# Altium schematic sheet [3] CAN.SchDoc
size A4; DocumentNumber: 3; SheetNumber: 4; SheetTotal: 10
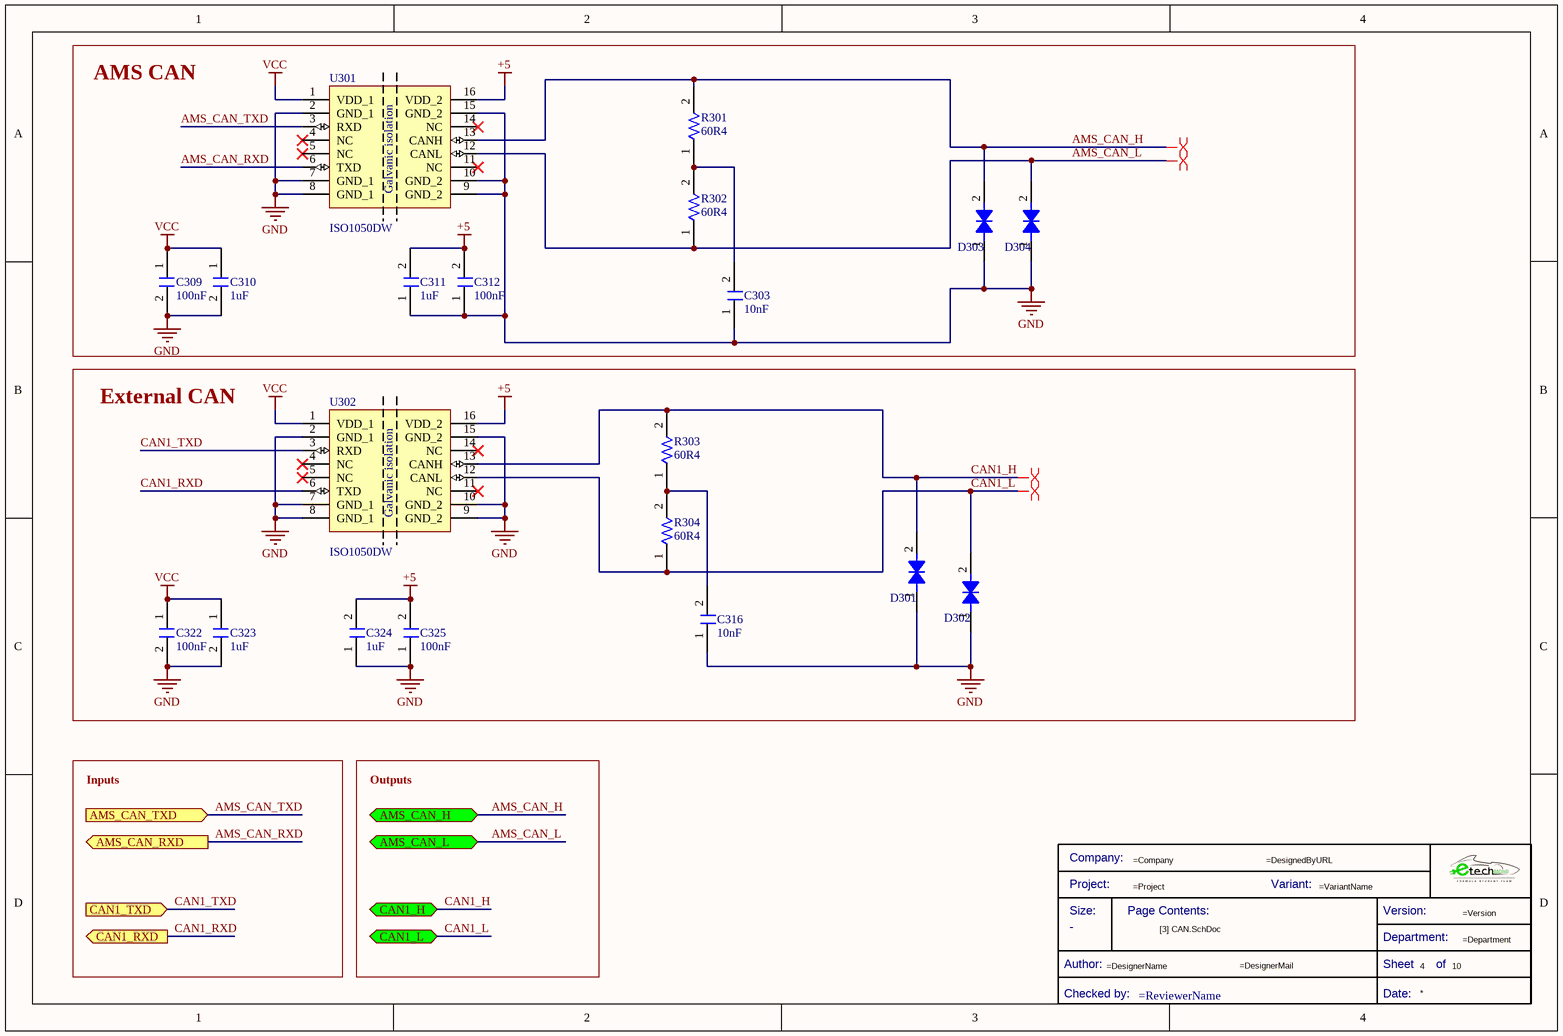
[diagram p0: [3] CAN.SchDoc]

## Parts
*  Title Block_template  (value not drawn)  (graphical)
C303  Capacitance: 10nF  [C0805FNPC-R]  (hidden comment: 885012207092)
C309  Capacitance: 100nF  [C0805FNPC-R]  (hidden comment: 885012207098)
C310  Capacitance: 1uF  [C0805FNPC-R]  (hidden comment: 885012207103)
C311  Capacitance: 1uF  [C0805FNPC-R]  (hidden comment: 885012207103)
C312  Capacitance: 100nF  [C0805FNPC-R]  (hidden comment: 885012207098)
C316  Capacitance: 10nF  [C0805FNPC-R]  (hidden comment: 885012207092)
C322  Capacitance: 100nF  [C0805FNPC-R]  (hidden comment: 885012207098)
C323  Capacitance: 1uF  [C0805FNPC-R]  (hidden comment: 885012207103)
C324  Capacitance: 1uF  [C0805FNPC-R]  (hidden comment: 885012207103)
C325  Capacitance: 100nF  [C0805FNPC-R]  (hidden comment: 885012207098)
D301  824501600  [DTVS-DO-214AC]  (value not drawn)
D302  824501600  [DTVS-DO-214AC]  (value not drawn)
D303  824501600  [DTVS-DO-214AC]  (value not drawn)
D304  824501600  [DTVS-DO-214AC]  (value not drawn)
R301  value 60R4  [R0805FTK]  (hidden comment: R60-0805FTN)
R302  value 60R4  [R0805FTK]  (hidden comment: R60-0805FTN)
R303  value 60R4  [R0805FTK]  (hidden comment: R60-0805FTN)
R304  value 60R4  [R0805FTK]  (hidden comment: R60-0805FTN)
U301  ISO1050DW  [TRANSCEIVER_CAN_SOIC16]
U302  ISO1050DW  [TRANSCEIVER_CAN_SOIC16]

## Blocks framed on the sheet
AMS CAN: C303 C309-C312 D303 D304 R301 R302 U301
External CAN: C316 C322-C325 D301 D302 R303 R304 U302

## Ports
AMS_CAN_H (bidir), AMS_CAN_L (bidir), AMS_CAN_RXD (out), AMS_CAN_TXD (in), CAN1_H (bidir), CAN1_L (bidir), CAN1_RXD (out), CAN1_TXD (in)

## Nets
+5: C311.2 C312.2 C324.2 C325.2 U301.16(VDD_2) U302.16(VDD_2)
GND: C303.1 C309.2 C310.2 C311.1 C312.1 C316.1 C322.2 C323.2 C324.1 C325.1 D301.1 D302.1 D303.1 D304.1 U301.2(GND_1) U301.7(GND_1) U301.8(GND_1) U301.9(GND_2) U301.10(GND_2) U301.15(GND_2) U302.2(GND_1) U302.7(GND_1) U302.8(GND_1) U302.9(GND_2) U302.10(GND_2) U302.15(GND_2)
VCC: C309.1 C310.1 C322.1 C323.1 U301.1(VDD_1) U302.1(VDD_1)
AMS_CAN_H: D303.2 R301.2 U301.13(CANH) ; port AMS_CAN_H
AMS_CAN_L: D304.2 R302.1 U301.12(CANL) ; port AMS_CAN_L
AMS_CAN_RXD: U301.6(TXD) ; port AMS_CAN_RXD
AMS_CAN_TXD: U301.3(RXD) ; port AMS_CAN_TXD
CAN1_H: D301.2 R303.2 U302.13(CANH) ; port CAN1_H
CAN1_L: D302.2 R304.1 U302.12(CANL) ; port CAN1_L
CAN1_RXD: U302.6(TXD) ; port CAN1_RXD
CAN1_TXD: U302.3(RXD) ; port CAN1_TXD
NetC303_2: C303.2 R301.1 R302.2
NetC316_2: C316.2 R303.1 R304.2

Not connected (* = marked no-connect by the designer): U301 4(NC)* 5(NC)* 11(NC)* 14(NC)*; U302 4(NC)* 5(NC)* 11(NC)* 14(NC)*

## Layout directives
differential pair: AMS_CAN_H, AMS_CAN_L, CAN1_H, CAN1_L

## Notes on the sheet
- Inputs
- Outputs
- Title
- Size:
- Date:
- A4
- Number:
- Time:
- Revision:
- Sheet
- of
- File:
- (in symbol Title Block_template) Company:; Project:; Variant:; Size:; Page Contents:; Version:; Department:; Author:; Sheet; of; Checked by:; Date:
- (in symbol Transceiver_CAN_ISO1050) Galvanic isolation

## Library data of the parts
* = Title Block_template: Standard Title Block; Category: Title Block; Checked by:: =ReviewerName; Size: -
C303 C316 = C10n-50V-0805FNPC-X7R: Cap, 0.01ΜF, 50V, 10%, X7R, 0805; Manufacturer 1: Wurth Electronics; .Creator: DR; Supplier 1: RSComponents; Manufacturer Part Number 1: 885012207092; RoHS: Yes; Category: Ceramic Capacitors; Stock 1: 1; Pricing 1: 4000=0,03200, 12000=0,03100 (USD); Mount: Surface Mount; Case/Package: 0805; Case Code (Metric): 2012; Case Code (Imperial): 0805; Min Operating Temperature: -55°C; Max Operating Temperature: 125°C; Packaging: Cut Tape; Voltage Rating: 50V; Dielectric: X7R; Tolerance: 10%; Voltage Rating (DC): 50V; Length: 0.079inch; Width: 0.049inch; Thickness: 0.035inch; REACH SVHC: Unknown; RoHS Compliant: Yes; ComponentLink1URL: http://www.farnell.com/datasheets/1958497.pdf?src-supplier=Farnell; ComponentLink1Description: http://www.farnell.com/datasheets/1958497.pdf?src-supplier=Farnell; ComponentLink2URL: http://www.farnell.com/datasheets/1958497.pdf?src-supplier=Element14; ComponentLink2Description: http://www.farnell.com/datasheets/1958497.pdf?src-supplier=Element14; ComponentLink3URL: http://www.farnell.com/datasheets/1958497.pdf?src-supplier=Newark; ComponentLink3Description: http://www.farnell.com/datasheets/1958497.pdf?src-supplier=Newark; ComponentLink4URL: https://katalog.we-online.de/pbs/datasheet/885012207092.pdf?src-supplier=Digi-Key; ComponentLink4Description: https://katalog.we-online.de/pbs/datasheet/885012207092.pdf?src-supplier=Digi-Key; Supplier Part Number 1: 1813941
C309 C312 C322 C325 = C100n-50V-0805FNPC-X7R: Cap, 0.1ΜF, 50V, 10%, X7R, 0805; Manufacturer 1: Wurth Electronics; .Creator: DR; Supplier 1: RSComponents; Manufacturer Part Number 1: 885012207098; RoHS: Yes; Category: Ceramic Capacitors; Stock 1: 8000; Pricing 1: 100=0,10200, 500=0,07100, 2000=0,06100 (GBP); Mount: Surface Mount; Case/Package: 0805; Case Code (Metric): 2012; Case Code (Imperial): 0805; Min Operating Temperature: -55°C; Max Operating Temperature: 125°C; Packaging: Cut Tape; Voltage Rating: 50V; Dielectric: X7R; Tolerance: 10%; Voltage Rating (DC): 50V; Length: 0.079inch; Width: 0.049inch; Thickness: 0.035inch; REACH SVHC: Unknown; RoHS Compliant: Yes; ComponentLink1URL: http://www.farnell.com/datasheets/1958498.pdf?src-supplier=Farnell; ComponentLink1Description: http://www.farnell.com/datasheets/1958498.pdf?src-supplier=Farnell; ComponentLink2URL: http://www.farnell.com/datasheets/1958498.pdf?src-supplier=Element14; ComponentLink2Description: http://www.farnell.com/datasheets/1958498.pdf?src-supplier=Element14; ComponentLink3URL: https://katalog.we-online.de/pbs/datasheet/885012207098.pdf?src-supplier=Digi-Key; ComponentLink3Description: https://katalog.we-online.de/pbs/datasheet/885012207098.pdf?src-supplier=Digi-Key; ComponentLink4URL: http://www.farnell.com/datasheets/1958498.pdf?src-supplier=Newark; ComponentLink4Description: http://www.farnell.com/datasheets/1958498.pdf?src-supplier=Newark; Supplier Part Number 1: 1813493
C310 C311 C323 C324 = C1u-50V-0805FNPC-X7R: Multilayer Ceramic Capacitor, Wcap-Csgp Series, 1 F, 10%, X7R, 50 V, 0805 [2012 Metric] Rohs Compliant: Yes; Manufacturer 1: Wurth Electronics; Voltage Rating: 50V; .Creator: GP; Supplier 1: RSComponents; Manufacturer Part Number 1: 885012207103; RoHS: Yes; Category: Ceramic Capacitors; Stock 1: 5100; Pricing 1: 50=0,27200, 250=0,25300, 500=0,22800, 1250=0,20100, 2500=0,17100 (GBP); Mount: Surface Mount; Case/Package: 0805; Case Code (Metric): 2012; Case Code (Imperial): 0805; Min Operating Temperature: -55°C; Max Operating Temperature: 85°C; Packaging: Cut Tape; Dielectric: X7R; Tolerance: 10%; Voltage Rating (DC): 50V; Length: 0.079inch; Width: 0.049inch; Thickness: 0.053inch; REACH SVHC: Unknown; RoHS Compliant: Yes; ComponentLink1URL: http://www.farnell.com/datasheets/1958501.pdf?src-supplier=Farnell; ComponentLink1Description: http://www.farnell.com/datasheets/1958501.pdf?src-supplier=Farnell; ComponentLink2URL: http://www.farnell.com/datasheets/1958501.pdf?src-supplier=Element14; ComponentLink2Description: http://www.farnell.com/datasheets/1958501.pdf?src-supplier=Element14; ComponentLink3URL: https://katalog.we-online.de/pbs/datasheet/885012107003.pdf?src-supplier=Digi-Key; ComponentLink3Description: https://katalog.we-online.de/pbs/datasheet/885012107003.pdf?src-supplier=Digi-Key; ComponentLink4URL: http://www.farnell.com/datasheets/1958501.pdf?src-supplier=Newark; ComponentLink4Description: http://www.farnell.com/datasheets/1958501.pdf?src-supplier=Newark; Supplier Part Number 1: 1813523
D301-D304 = DTVS-6V-DO-214AC: TVS diode [Würth Elektronik] 824501600 TVS diode; Manufacturer: Wurth Electronics; Number of Bidirectional Channels: 1; Reverse Standoff Voltage: 6V; Min Breakdown Voltage: 7.02V; Clamping Voltage: 10.3V; Peak Pulse Power: 400W; Power Line Protection: No; Polarity: Bidirectional; Peak Pulse Current: 38.8A; .Creator: DO; ComponentLink1Description: Where buy it; ComponentLink1URL: https://www.we-online.com/catalog/en/WE-TVSP?sq=824501600#824501600; Supplier 1: Mouser; Manufacturer Part Number: 824501600; RoHS: Yes; Category: TVS Diodes; Stock 1: 780; Pricing 1: 1=0,28000, 10=0,26100, 50=0,26100, 100=0,23400, 500=0,20400, 1000=0,17400, 10000=0,17400 (USD); Mount: Surface Mount; Number of Pins: 2; Min Operating Temperature: -65°C; Max Operating Temperature: 150°C; Packaging: Cut Tape; Max Breakdown Voltage: 7.02V; Resistor Type: Zener; REACH SVHC: Unknown; RoHS Compliant: Yes; ComponentLink2URL: http://www.farnell.com/datasheets/2036401.pdf?src-supplier=Element14; ComponentLink2Description: http://www.farnell.com/datasheets/2036401.pdf?src-supplier=Element14; Supplier Part Number 1: 710-824501600; ComponentLink3URL: https://katalog.we-online.de/pbs/datasheet/824501600.pdf?src-supplier=Digi-Key; ComponentLink3Description: https://katalog.we-online.de/pbs/datasheet/824501600.pdf?src-supplier=Digi-Key
R301-R304 = R60-0805FTN: Res Thin Film 0805 60.4 Ohm 0.1% 1/8W ±25ppm/°C Molded SMD SMD Punched Carrier T/R; Manufacturer 1: Panasonic; Manufacturer Part Number 1: ERA-6AEB60R4V; Resistance: 60.4R; Voltage Rating (DC): 100V; Max Power Dissipation: 125mW; Voltage Rating: 200V; .Creator: DR; Supplier 1: Arrow Electronics; RoHS: Yes; Category: Chip SMD Resistors; Stock 1: 5000; Pricing 1: 1=0,04650, 10=0,03900, 100=0,02860 (USD); Mount: Surface Mount; Case/Package: 0805; Number of Pins: 2; Contact Plating: Tin; Weight: 0.000194oz; Case Code (Metric): 2012; Case Code (Imperial): 0805; Min Operating Temperature: -55°C; Max Operating Temperature: 155°C; Temperature Coefficient: 25ppm/°C; Tolerance: 0.1%; Resistor Type: Thin Film,Metal Film; Features: Automotive AEC-Q200; Package Quantity: 5000; Number of Terminations: 2; Termination: SMD/SMT; Power Rating: 125mW; Packaging: Tape and Reel; Length: 2mm; Width: 1.25mm; Height: 0.5mm; Depth: 1.25mm; Radiation Hardening: No; Lead Free: Lead Free; ComponentLink1URL: https://datasheet.ciiva.com/11811/0900766b80eb1d8c-11811180.pdf?src-supplier=RSComponents; ComponentLink1Description: https://datasheet.ciiva.com/11811/0900766b80eb1d8c-11811180.pdf?src-supplier=RSComponents; ComponentLink2URL: https://datasheet.ciiva.com/41450/001181146-da-01-en-widerstand-era-0805-60r4-0-1-5000st-41450303.pdf?src-supplier=Conrad; ComponentLink2Description: https://datasheet.ciiva.com/41450/001181146-da-01-en-widerstand-era-0805-60r4-0-1-5000st-41450303.pdf?src-supplier=Conrad; ComponentLink3URL: https://datasheet.ciiva.com/5951/485442-5951173.pdf?src-supplier=Farnell; ComponentLink3Description: https://datasheet.ciiva.com/5951/485442-5951173.pdf?src-supplier=Farnell; ComponentLink4URL: https://datasheet.ciiva.com/30184/54aoa0000ce26-30184022.pdf?src-supplier=Onlinecomponents.com; ComponentLink4Description: https://datasheet.ciiva.com/30184/54aoa0000ce26-30184022.pdf?src-supplier=Onlinecomponents.com; ComponentLink5URL: https://datasheet.ciiva.com/9188/aoa0000ce26-9188476.pdf?src-supplier=Avnet; ComponentLink5Description: https://datasheet.ciiva.com/9188/aoa0000ce26-9188476.pdf?src-supplier=Avnet; Supplier Part Number 1: ERA-6AEB60R4V
U301 U302 = Transceiver_CAN_ISO1050: Isolated 5-V CAN transceiver 16-SOIC -55 to 105; Manufacturer 1: Texas Instruments; Data Rate: 1Mbps; Number of Transceivers: 1; Propagation Delay: 74ns; Min Supply Voltage: 3V; Max Supply Voltage: 5.5V; Working Voltage: 1.2V; Polarity: Unidirectional; Operating Supply Current: 2mA; Max Supply Current: 73mA; .Creator: DR; ComponentLink1URL: https://datasheet.ciiva.com/22630/1719733-22630777.pdf?src-supplier=Element14; ComponentLink1Description: Datasheet; ComponentLink2Description: Where buy it; ComponentLink2URL: Try again in 2023; Supplier 1: Arrow Electronics; Manufacturer Part Number 1: ISO1050DW; RoHS: Yes; Category: Interface ICs; Stock 1: 60; Pricing 1: 1=4,02740 (USD); Case/Package: SOIC; Number of Pins: 16; Contact Plating: Gold; Weight: 0.019312oz; Min Operating Temperature: -55°C; Max Operating Temperature: 105°C; Packaging: Bulk; Package Quantity: 40; Number of Channels: 1; Number of Drivers: 1; Series: -; Number of Transmit Buffers: 1; Number of Receive Buffers: 1; Length: 10.5mm; Width: 7.6mm; Height: 2.35mm; Radiation Hardening: No; Lead Free: Lead Free; RoHS Compliant: Yes; REACH SVHC: No SVHC; ComponentLink3URL: https://datasheet.ciiva.com/22630/1719733-22630777.pdf?src-supplier=Element14; ComponentLink3Description: https://datasheet.ciiva.com/22630/1719733-22630777.pdf?src-supplier=Element14; ComponentLink4URL: https://datasheet.ciiva.com/26830/iso1050dw-26830433.pdf?src-supplier=IIIC; ComponentLink4Description: https://datasheet.ciiva.com/26830/iso1050dw-26830433.pdf?src-supplier=IIIC; ComponentLink5URL: https://datasheet.ciiva.com/1772/iso1050-1772965.pdf?src-supplier=Digi-Key; ComponentLink5Description: https://datasheet.ciiva.com/1772/iso1050-1772965.pdf?src-supplier=Digi-Key; Supplier Part Number 1: ISO1050DW